# EasyEDA Pro project wireless charger controller.eprj

# Schematic Schematic1
Board Name: Board1; Create Date: 2025-02-25; Page Name: P1; Project Name: wireless charger controller; Schematic Name: Schematic1; Update Date: 2025-03-02; Company: 嘉立创EDA; Page Size: A4; Version: V1.0
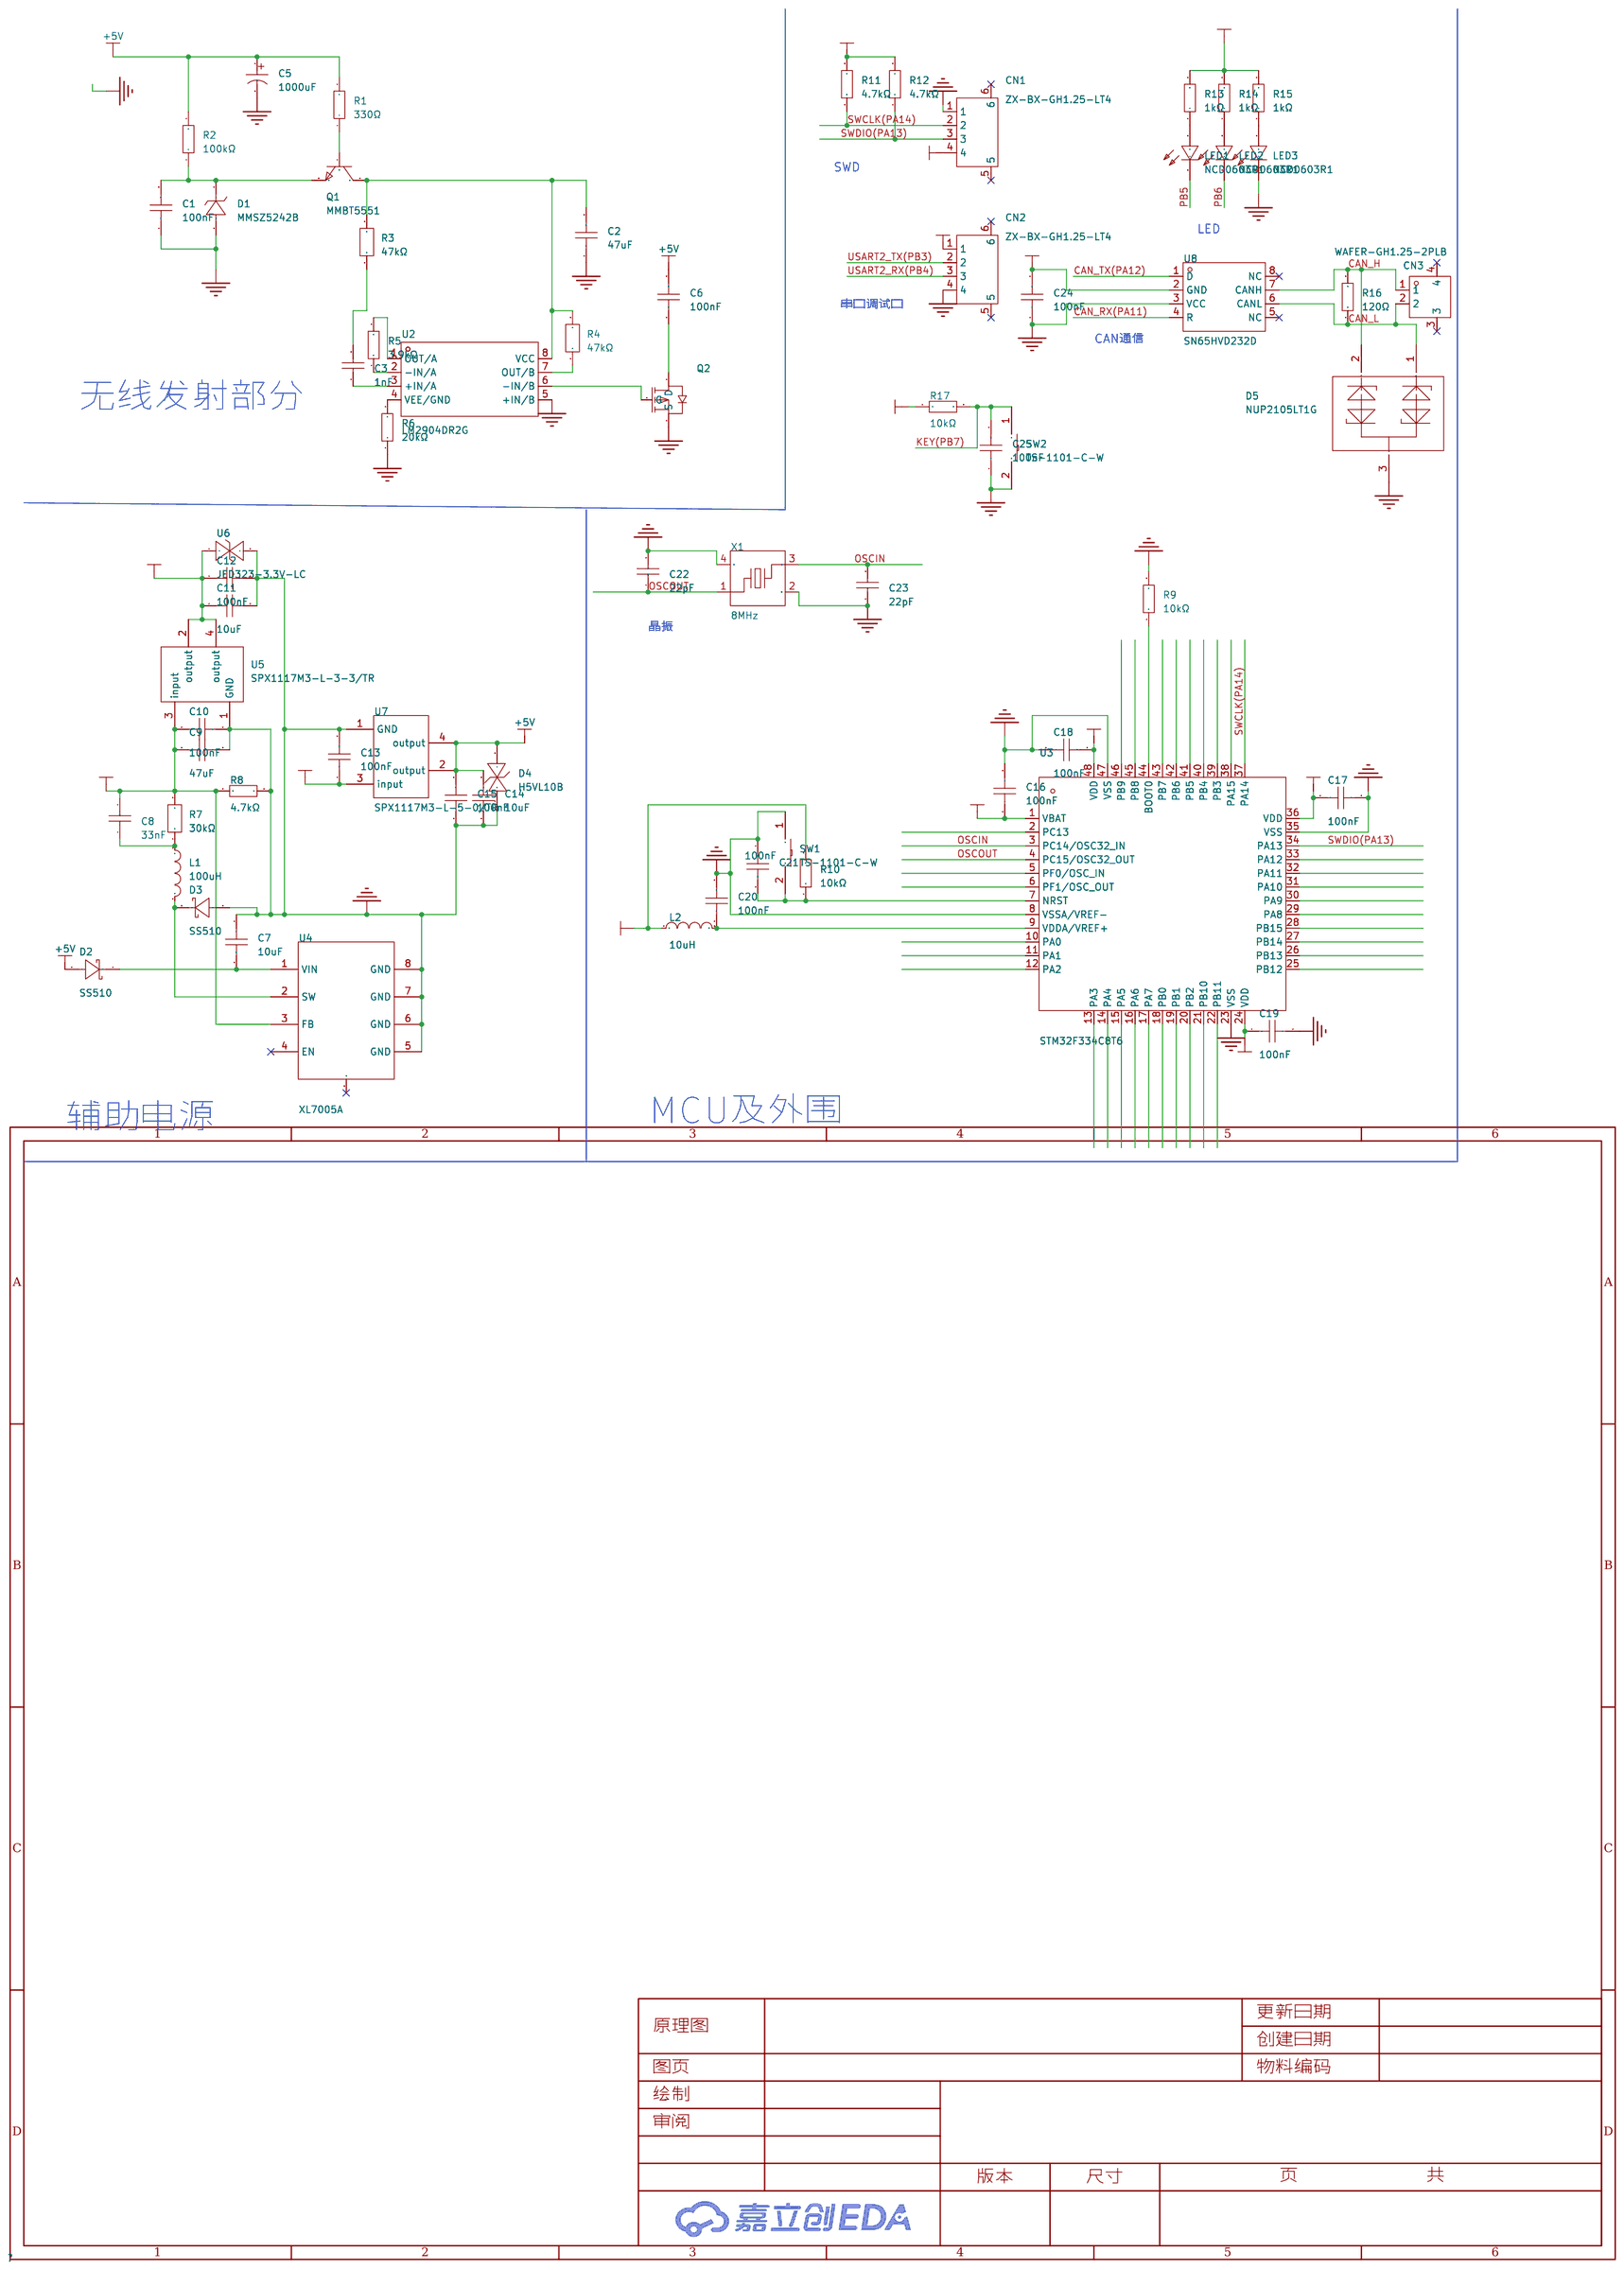
[diagram p0: schematic sheet]

## Parts
C1  100nF  [C0603]
C2  47uF  [C1206]
C3  1nF  [C0603]
C5  1000uF  [CAP-TH_BD13.0-P5.00-D1.2-FD]
C6  100nF  [C1206]
C7  10uF  [C1206]
C8  33nF  [C0603]
C9  47uF  [C1206]
C10  100nF  [C0603]
C11  10uF  [C0603]
C12  100nF  [C0603]
C13  100nF  [C0603]
C14  10uF  [C0603]
C15  100nF  [C0603]
C16  100nF  [C0603]
C17  100nF  [C0603]
C18  100nF  [C0603]
C19  100nF  [C0603]
C20  100nF  [C0603]
C21  100nF  [C0603]
C22  22pF  [C0603]
C23  22pF  [C0603]
C24  100nF  [C0603]
C25  100nF  [C0603]
CN1  ZX-BX-GH1.25-LT4  [CONN-SMD_ZX-BX-GH1.25-LT4]
CN2  ZX-BX-GH1.25-LT4  [CONN-SMD_ZX-BX-GH1.25-LT4]
CN3  WAFER-GH1.25-2PLB  [CONN-TH_2P-P1.25_XUNPU_WAFER-GH1.25-2PLB]
D1  MMSZ5242B  [SOD-123_L2.7-W1.6-LS3.7-RD]
D2  SS510  [SMA_L4.3-W2.6-LS5.0-RD]
D3  SS510  [SMA_L4.3-W2.6-LS5.0-RD]
D4  H5VL10B  [SOD-882_L1.0-W0.6-BI]
D5  NUP2105LT1G  [SOT-23-3_L2.9-W1.3-P1.90-LS2.4-BL-2]
L1  100uH  [IND-SMD_L6.0-W6.0_FNR60XXS]
L2  10uH  [L0603]
LED1  NCD0603R1  [LED0603-RD_RED]
LED2  NCD0603R1  [LED0603-RD_RED]
LED3  NCD0603R1  [LED0603-RD_RED]
Q1  MMBT5551  [SOT-23-3_L2.9-W1.3-P1.90-LS2.4-BR]
Q2  -  [IRF9540P_TO-220]
R1  330Ω  [R0603]
R2  100kΩ  [R0603]
R3  47kΩ  [R0603]
R4  47kΩ  [R0603]
R5  3.9kΩ  [R0603]
R6  20kΩ  [R0603]
R7  30kΩ  [R0603]
R8  4.7kΩ  [R0603]
R9  10kΩ  [R0603]
R10  10kΩ  [R0603]
R11  4.7kΩ  [R0603]
R12  4.7kΩ  [R0603]
R13  1kΩ  [R0603]
R14  1kΩ  [R0603]
R15  1kΩ  [R0603]
R16  120Ω  [R0603]
R17  10kΩ  [R0603]
SW1  TS-1101-C-W  [SW-SMD_L6.0-W3.3-LS8.0]
SW2  TS-1101-C-W  [SW-SMD_L6.0-W3.3-LS8.0]
U2  LM2904DR2G  [SOIC-8_L4.9-W3.9-P1.27-LS6.0-BL]
U3  STM32F334C8T6  [LQFP-48_L7.0-W7.0-P0.50-LS9.0-BL]
U4  XL7005A  [SOIC-8_L4.9-W3.9-P1.27-LS6.0-BL-EP3.1-1]
U5  SPX1117M3-L-3-3/TR  [SOT-223-4_L6.5-W3.5-P2.30-LS7.0-BR]
U6  JED323-3.3V-LC  [SOD-323_L1.7-W1.3-LS2.5-BI]
U7  SPX1117M3-L-5-0/TR  [SOT-223-4_L6.5-W3.5-P2.30-LS7.0-BR]
U8  SN65HVD232D  [SOIC-8_L4.9-W3.9-P1.27-LS6.0-TL]
X1  8MHz  [CRYSTAL-SMD_4P-L3.2-W2.5-BL]

## Library data of the parts
C1 C10 C12 C13 C15-C21 C24 C25 = CGA0603X7R104K500JT: LCSC Part Name: 100nF ±10% 50V; Supplier Part: C6119867; Manufacturer: HRE(芯声); Supplier Footprint: 0603; JLCPCB Part Class: 扩展库; Supplier: LCSC; Tolerance: ±10%; Voltage Rated: 50V; Temperature Coefficient: X7R
C2 = HGC1206R5476M160NSPJ: LCSC Part Name: 47uF ±20% 16V; Supplier Part: C7472975; Manufacturer: Chinocera(华瓷); Supplier Footprint: 1206; JLCPCB Part Class: 扩展库; Datasheet: https://atta.szlcsc.com/upload/public/pdf/source/20240320/FAC3FEC40A78BC5CCCE96C232A94D860.pdf; Supplier: LCSC; Tolerance: ±20%; Voltage Rated: 16V; Temperature Coefficient: X5R
C3 = CC0603JRNPO9BN102: LCSC Part Name: 1nF ±5% 50V; Supplier Part: C106246; Manufacturer: YAGEO(国巨); Supplier Footprint: 0603; JLCPCB Part Class: 扩展库; Datasheet: https://atta.szlcsc.com/upload/public/pdf/source/20170505/1493957838062.pdf; Supplier: LCSC; Tolerance: ±5%; Voltage Rated: 50V; Temperature Coefficient: NP0
C5 = 35YXJ1000M12.5X20: LCSC Part Name: 1000uF ±20% 35V; Supplier Part: C88743; Manufacturer: rubycon(红宝石); Supplier Footprint: 插件,D12.5xL20mm; JLCPCB Part Class: 扩展库; Datasheet: https://atta.szlcsc.com/upload/public/pdf/source/20200113/C88743_7A9E1D91AFF2E9AFD34B160DBDD0EC66.pdf; Supplier: LCSC; Tolerance: ±20%; Rated Voltage: 35V; Lead Spacing: 5mm; φD: 12.5mm; L: 20mm; Lifetime @ Temp: 10000hrs@105℃
C6 = CGA1206X7R104K251NT: LCSC Part Name: 100nF ±10% 250V; Supplier Part: C7503480; Manufacturer: HRE(芯声); Supplier Footprint: 1206; JLCPCB Part Class: 扩展库; Datasheet: https://atta.szlcsc.com/upload/public/pdf/source/20240119/D701C2A0801BCB6D531D69151EC650B3.pdf; Supplier: LCSC; Tolerance: ±10%; Voltage Rated: 250V; Temperature Coefficient: X7R
C7 = HGC1206R5106K500NSPJ: LCSC Part Name: 10uF ±10% 50V; Supplier Part: C7432781; Manufacturer: Chinocera(华瓷); Supplier Footprint: 1206; JLCPCB Part Class: 扩展库; Datasheet: https://atta.szlcsc.com/upload/public/pdf/source/20240320/FAC3FEC40A78BC5CCCE96C232A94D860.pdf; Supplier: LCSC; Tolerance: ±10%; Voltage Rated: 50V; Temperature Coefficient: X5R
C8 = CL10B333KB8NNNC: LCSC Part Name: 33nF ±10% 50V; Supplier Part: C21117; Manufacturer: SAMSUNG(三星); Supplier Footprint: 0603; JLCPCB Part Class: 基础库; Datasheet: https://atta.szlcsc.com/upload/public/pdf/source/20160218/1457707763339.pdf; Supplier: LCSC; Tolerance: ±10%; Voltage Rated: 50V; Temperature Coefficient: X7R
C9 = HGC1206R5476M250NSPJ: LCSC Part Name: 47uF ±20% 25V; Supplier Part: C22367835; Manufacturer: Chinocera(华瓷); Supplier Footprint: 1206; JLCPCB Part Class: 扩展库; Datasheet: https://atta.szlcsc.com/upload/public/pdf/source/20240326/E6CB0DC43BB858B74F4352229FABFDCA.pdf; Supplier: LCSC; Tolerance: ±20%; Voltage Rated: 25V; Temperature Coefficient: X5R
C11 C14 = CGA0603X5R106K100JT: LCSC Part Name: 10uF ±10% 10V; Supplier Part: C6119842; Manufacturer: HRE(芯声); Supplier Footprint: 0603; JLCPCB Part Class: 扩展库; Supplier: LCSC; Tolerance: ±10%; Voltage Rated: 10V; Temperature Coefficient: X5R
C22 C23 = CC0603JRNPO9BN220: LCSC Part Name: 22pF ±5% 50V; Supplier Part: C105620; Manufacturer: YAGEO(国巨); Supplier Footprint: 0603; JLCPCB Part Class: 扩展库; Datasheet: https://atta.szlcsc.com/upload/public/pdf/source/20170505/1493957838062.pdf; Supplier: LCSC; Tolerance: ±5%; Voltage Rated: 50V; Temperature Coefficient: NP0
CN1 CN2 = ZX-BX-GH1.25-LT4: LCSC Part Name: 1x4P 间距:1.25mm 立贴 系列:GH; Supplier Part: C7429508; Manufacturer: Megastar(兆星); Supplier Footprint: SMD,P=1.25mm; JLCPCB Part Class: 扩展库; Datasheet: https://atta.szlcsc.com/upload/public/pdf/source/20230619/3EA3860FAE766B302258B62130360A2E.pdf; Supplier: LCSC; Pins Structure: 1x4P; Pitch: 1.25mm; Mounting Type: 立贴; Reference Series: GH; Number of Pins: 4P; Number of Rows: 1; Number of PINs Per Row: 4; Contact Material: 磷铜; Contact Plating: 锡; Supplementary Features: 辅助焊脚; Color: 米色; Z-Height of the Board: 4.2mm; X-Length of Bottom Edge on Board (Spacing Line): 8.25mm; Y-Width of Bottom Edge on Board: 4.25mm
CN3 = WAFER-GH1.25-2PLB: LCSC Part Name: 1x2P 间距:1.25mm 立贴 系列:GH; Supplier Part: C3029368; Manufacturer: XUNPU(讯普); Supplier Footprint: SMD,P=1.25mm; JLCPCB Part Class: 扩展库; Datasheet: https://atta.szlcsc.com/upload/public/pdf/source/20220527/44F824AAC8C2B617205E15955FF9C23D.pdf; Supplier: LCSC; Pins Structure: 1x2P; Pitch: 1.25mm; Mounting Type: 立贴; Reference Series: GH; Number of Pins: 2P; Number of Rows: 1; Number of PINs Per Row: 2; Current Rating: 1A; Contact Material: 黄铜; Operating Temperature: -25℃~+85℃; Voltage Rating: 125V; Plastic Material: LCP; Supplementary Features: 辅助焊脚; Color: 米色; Z-Height of the Board: 4.2mm; X-Length of Bottom Edge on Board (Spacing Line): 5.75mm; Y-Width of Bottom Edge on Board: 4.95mm
D1 = MMSZ5242B_C19077426: Supplier Part: C19077426; Manufacturer: 宏嘉诚; Supplier Footprint: SOD-123; JLCPCB Part Class: 扩展库; Datasheet: https://atta.szlcsc.com/upload/public/pdf/source/20250106/06B28F2C24D17E0AE22ECF6A1A26EDF7.pdf; Supplier: LCSC; Diode Configuration: 独立式; Zener Voltage(Nom): 12V; Reverse Leakage Current (Ir): 1uA@9.1V; Zener Voltage(Range): 11.4V~12.6V; Pd - Power Dissipation(Pd): 500mW; Impedance(Zzt): 30Ω
D2 D3 = SS510_C18199171: LCSC Part Name: 电压:100V 电流:5A; Supplier Part: C18199171; Manufacturer: 宏迦橙; Supplier Footprint: SMA(DO-214AC); JLCPCB Part Class: 扩展库; Datasheet: https://atta.szlcsc.com/upload/public/pdf/source/20230828/254C3882F8647358AD9F60DD73611B5E.pdf; Supplier: LCSC; Diode Configuration: 独立式; Forward Voltage (Vf@If): 850mV@5A; Reverse Voltage (Vr): 100V; Rectified Current: 5A; Reverse Leakage Current (Ir): 50uA@100V
D4 = H5VL10B: LCSC Part Name: H5VL10B 丝印 PB; Supplier Part: C7420372; Manufacturer: 宏迦橙; Supplier Footprint: DFN1006-2L; JLCPCB Part Class: 扩展库; Datasheet: https://atta.szlcsc.com/upload/public/pdf/source/20230630/5024ECFEAD3C9801B07A8DBB967AB462.pdf; Supplier: LCSC; polarity: 双向; Reverse Stand-Off Voltage (Vrwm): 5V; Maximum Clamping Voltage: 10V; Peak Pulse Current (Ipp): 5A; Peak Pulse Power Dissipation (Ppp): 50W; Breakdown Voltage: 5.6V; Reverse Leakage Current (Ir): 100nA; Number of Lines: 单路; Operating Temperature: -55℃~+155℃; Type: ESD
D5 = NUP2105LT1G_C14486: Supplier Part: C14486; Manufacturer: onsemi(安森美); Supplier Footprint: SOT-23; JLCPCB Part Class: 扩展库; Datasheet: https://atta.szlcsc.com/upload/public/pdf/source/20140815/1457707217812.pdf; Supplier: LCSC; Reverse Stand-Off Voltage (Vrwm): 24V; Maximum Clamping Voltage: 44V; Peak Pulse Power Dissipation (Ppp)@10/1000us: 350W; Breakdown Voltage: 26.2V; Number of Lines: 双路; Operating Temperature: -55℃~+150℃@(Tj); Type: ESD
L1 = FNR6045S101MT: LCSC Part Name: 100uH ±20% 1A; Supplier Part: C168095; Manufacturer: cjiang(长江微电); Supplier Footprint: SMD,6x6mm; JLCPCB Part Class: 扩展库; Datasheet: https://atta.szlcsc.com/upload/public/pdf/source/20190327/C167925_9EFF0AABC4CA629C2CC95961DBF7D39D.pdf; Supplier: LCSC; Tolerance: ±20%; Rated Current: 880mA; Saturation Current (Isat): 1A; DC Resistance (DCR): 563mΩ
L2 = MCL1608S100MT: LCSC Part Name: 10uH ±20%; Supplier Part: C51942; Manufacturer: Sunlord(顺络); Supplier Footprint: 0603; JLCPCB Part Class: 扩展库; Datasheet: https://atta.szlcsc.com/upload/public/pdf/source/20241120/F98A73BCE98B3F58AF96E60C5F2B82D5.pdf; Supplier: LCSC; Tolerance: ±20%; Current Rating: 50mA; DC Resistance(DCR): 1.17Ω; Frequency - Self Resonant: 20MHz
LED1-LED3 = NCD0603R1_C84263: Supplier Part: C84263; Manufacturer: 国星光电; Supplier Footprint: 0603; JLCPCB Part Class: 扩展库; Datasheet: https://atta.szlcsc.com/upload/public/pdf/source/20200820/C84263_DABC6A75E58F576973B407FDBA283D60.pdf; Supplier: LCSC; Emitted Color: 红色; Forward Voltage (VF): 1.6V~2.6V; Power Dissipation: 65mW; Forward Current: 20mA; Dominant Wavelength: 615nm~630nm; Diode Configuration: 独立二极管; Lens Color: 无色透明透镜; Luminous Intensity: 80mcd~220mcd; Viewing Angle: 130°; Operating Temperature: -30℃~+85℃
Q1 = MMBT5551_C7420357: LCSC Part Name: hFE:100-300; Supplier Part: C7420357; Manufacturer: 宏迦橙; Supplier Footprint: SOT-23; JLCPCB Part Class: 扩展库; Datasheet: https://atta.szlcsc.com/upload/public/pdf/source/20231222/D38E1B30E95EC4C2952AC0E289834E8E.pdf; Supplier: LCSC; Transistor Type: NPN; Collector Current (Ic): 600mA; Collector-Emitter Breakdown Voltage (Vceo): 160V; Power Dissipation (Pd): 300mW; DC Current Gain (hFE@Ic,Vce): 100@10mA,5.0V; Transition Frequency (fT): 100MHz; Collector Cut-Off Current (Icbo): 50nA; Collector-Emitter Saturation Voltage (VCE(sat)@Ic,Ib): 150mV@10mA,1.0mA; Operating Temperature: -55℃~+150℃
Q2 = IRF9540_P: Supplier Footprint: TO-220-3
R1 = 0603WAF3300T5E: LCSC Part Name: 330Ω ±1% 100mW 厚膜电阻; Supplier Part: C23138; Manufacturer: UNI-ROYAL(厚声); Supplier Footprint: 0603; JLCPCB Part Class: 基础库; Datasheet: https://atta.szlcsc.com/upload/public/pdf/source/20200306/C422600_1E6D84923E4A46A82E41ADD87F860B5C.pdf; Supplier: LCSC; Type: 厚膜电阻; Tolerance: ±1%; Power(Watts): 100mW; Overload Voltage (Max): 75V; Temperature Coefficient: ±100ppm/℃; Operating Temperature Range: -55℃~+155℃
R2 = 0603WAF1003T5E: LCSC Part Name: 100kΩ ±1% 100mW 厚膜电阻; Supplier Part: C25803; Manufacturer: UNI-ROYAL(厚声); Supplier Footprint: 0603; JLCPCB Part Class: 基础库; Datasheet: https://atta.szlcsc.com/upload/public/pdf/source/20200306/C422600_1E6D84923E4A46A82E41ADD87F860B5C.pdf; Supplier: LCSC; Type: 厚膜电阻; Tolerance: ±1%; Power(Watts): 100mW; Overload Voltage (Max): 75V; Temperature Coefficient: ±100ppm/℃; Operating Temperature Range: -55℃~+155℃
R3 R4 = FRC0603F4702TS: LCSC Part Name: 47kΩ ±1% 100mW 厚膜电阻; Supplier Part: C2907042; Manufacturer: FOJAN(富捷); Supplier Footprint: 0603; JLCPCB Part Class: 扩展库; Datasheet: https://atta.szlcsc.com/upload/public/pdf/source/20211221/925EC7D7225764EE0046F22065062C87.pdf; Supplier: LCSC; Type: 厚膜电阻; Tolerance: ±1%; Power(Watts): 100mW; Overload Voltage (Max): 75V; Temperature Coefficient: ±100ppm/℃; Operating Temperature Range: -55℃~+155℃
R5 = 0603WAF3901T5E: LCSC Part Name: 3.9kΩ ±1% 100mW 厚膜电阻; Supplier Part: C23018; Manufacturer: UNI-ROYAL(厚声); Supplier Footprint: 0603; JLCPCB Part Class: 基础库; Datasheet: https://atta.szlcsc.com/upload/public/pdf/source/20200306/C422600_1E6D84923E4A46A82E41ADD87F860B5C.pdf; Supplier: LCSC; Type: 厚膜电阻; Tolerance: ±1%; Power(Watts): 100mW; Overload Voltage (Max): 75V; Temperature Coefficient: ±100ppm/℃; Operating Temperature Range: -55℃~+155℃
R6 = 0603WAF2002T5E: LCSC Part Name: 20kΩ ±1% 100mW 厚膜电阻; Supplier Part: C4184; Manufacturer: UNI-ROYAL(厚声); Supplier Footprint: 0603; JLCPCB Part Class: 基础库; Datasheet: https://atta.szlcsc.com/upload/public/pdf/source/20200306/C422600_1E6D84923E4A46A82E41ADD87F860B5C.pdf; Supplier: LCSC; Type: 厚膜电阻; Tolerance: ±1%; Power(Watts): 100mW; Overload Voltage (Max): 75V; Temperature Coefficient: ±100ppm/℃; Operating Temperature Range: -55℃~+155℃
R7 = FRC0603F3002TS: LCSC Part Name: 30kΩ ±1% 100mW 厚膜电阻; Supplier Part: C2907025; Manufacturer: FOJAN(富捷); Supplier Footprint: 0603; JLCPCB Part Class: 扩展库; Datasheet: https://atta.szlcsc.com/upload/public/pdf/source/20211221/925EC7D7225764EE0046F22065062C87.pdf; Supplier: LCSC; Type: 厚膜电阻; Tolerance: ±1%; Power(Watts): 100mW; Overload Voltage (Max): 75V; Temperature Coefficient: ±100ppm/℃; Operating Temperature Range: -55℃~+155℃
R8 R11 R12 = 0603WAF4701T5E: LCSC Part Name: 4.7kΩ ±1% 100mW 厚膜电阻; Supplier Part: C23162; Manufacturer: UNI-ROYAL(厚声); Supplier Footprint: 0603; JLCPCB Part Class: 基础库; Datasheet: https://atta.szlcsc.com/upload/public/pdf/source/20200306/C422600_1E6D84923E4A46A82E41ADD87F860B5C.pdf; Supplier: LCSC; Type: 厚膜电阻; Tolerance: ±1%; Power(Watts): 100mW; Overload Voltage (Max): 75V; Temperature Coefficient: ±100ppm/℃; Operating Temperature Range: -55℃~+155℃
R9 R10 R17 = 0603WAF1002T5E: LCSC Part Name: 厚膜电阻 10kΩ ±1% 100mW; Supplier Part: C25804; Manufacturer: UNI-ROYAL(厚声); Supplier Footprint: 0603; JLCPCB Part Class: Basic Part; Datasheet: https://atta.szlcsc.com/upload/public/pdf/source/20200306/C422600_1E6D84923E4A46A82E41ADD87F860B5C.pdf; Supplier: LCSC; Type: 厚膜电阻; Tolerance: ±1%; Power(Watts): 100mW; Overload Voltage (Max): 75V; Temperature Coefficient: ±100ppm/℃; Operating Temperature Range: -55℃~+155℃
R13-R15 = 0603WAF1001T5E: LCSC Part Name: 1kΩ ±1% 100mW 厚膜电阻; Supplier Part: C21190; Manufacturer: UNI-ROYAL(厚声); Supplier Footprint: 0603; JLCPCB Part Class: 基础库; Datasheet: https://atta.szlcsc.com/upload/public/pdf/source/20200306/C422600_1E6D84923E4A46A82E41ADD87F860B5C.pdf; Supplier: LCSC; Type: 厚膜电阻; Tolerance: ±1%; Power(Watts): 100mW; Overload Voltage (Max): 75V; Temperature Coefficient: ±100ppm/℃; Operating Temperature Range: -55℃~+155℃
R16 = 0603WAF1200T5E: LCSC Part Name: 120Ω ±1% 100mW 厚膜电阻; Supplier Part: C22787; Manufacturer: UNI-ROYAL(厚声); Supplier Footprint: 0603; JLCPCB Part Class: 基础库; Datasheet: https://atta.szlcsc.com/upload/public/pdf/source/20200306/C422600_1E6D84923E4A46A82E41ADD87F860B5C.pdf; Supplier: LCSC; Type: 厚膜电阻; Tolerance: ±1%; Power(Watts): 100mW; Overload Voltage (Max): 75V; Temperature Coefficient: ±100ppm/℃; Operating Temperature Range: -55℃~+155℃
SW1 SW2 = TS-1101-C-W: LCSC Part Name: 6*3.6*2.5mm 立贴 轻触开关; Supplier Part: C318938; Manufacturer: XKB Connectivity(中国星坤); Supplier Footprint: SMD; JLCPCB Part Class: 扩展库; Datasheet: https://atta.szlcsc.com/upload/public/pdf/source/20200227/C318938_C2E53B1EEDE37D980A33616AC086DE53.pdf; Supplier: LCSC; Circuit: 单刀单掷; Actuator Style: 矩形按钮; Operating Force: 260gf; Mounting Style: 立贴; Switch Length: 6mm; Switch Width: 3.6mm; Switch Height: 2.5mm; Strike Gundam: 不带; Contact Current: 50mA; Voltage Rating (DC): 12V; Actuator/Cap Color: 白色带淡绿; With Lamp: 无; Mechanical Life: 5万次; Operating Temperature: -30℃~+85℃
U2 = LM2904DR2G: Supplier Part: C18229; Manufacturer: onsemi(安森美); Supplier Footprint: SOIC-8; JLCPCB Part Class: 扩展库; Datasheet: https://atta.szlcsc.com/upload/public/pdf/source/20241203/BA383AB6F92C1D3D0DD6D262792E2276.pdf; Supplier: LCSC; Number of Circuits: 双路; Maximum Power Supply Range (Vdd-Vss): 32V; Gain Bandwidth Product(GBP): 1MHz; Voltage - Input Offset(Vos): 7mV; Input Offset Voltage Drift (Vos TC): 7uV/℃; Current - Input Bias(Ib): 45nA; Common Mode Rejection Ratio (CMRR): 70dB; Quiescent Current: 1.5mA; Output Current: 40mA; Operating Temperature: -40℃~+85℃
U3 = STM32F334C8T6: LCSC Part Name: 带DSP和FPU的主流混合信号ARM Cortex-M4 MCU，具有64 KB Flash、72 MHz CPU、CCM、5 Msps 12位ADC、比较器、运算放大器和高分辨率定时器; Supplier Part: C99450; Manufacturer: ST(意法半导体); Supplier Footprint: LQFP-48(7x7); JLCPCB Part Class: 扩展库; Datasheet: https://atta.szlcsc.com/upload/public/pdf/source/20180105/C99450_15151501269081234225.pdf; Supplier: LCSC; CPU Core: ARM-M4; CPU Maximum Speed: 72MHz; Program Storage Size: 64KB; Program Memory Type: FLASH; Number of I/O: 37; ADC (Bit): 12bit; DAC (Bit): 12bit; Low Voltage Detection Threshold: 2V~3.6V
U4 = XL7005A: LCSC Part Name: 0.4A 150kHz 80V 降压型DC-DC转换器; Supplier Part: C50848; Manufacturer: XLSEMI(芯龙); Supplier Footprint: SOIC-8-EP; JLCPCB Part Class: 扩展库; Datasheet: https://atta.szlcsc.com/upload/public/pdf/source/20150821/1457707346919.pdf; Supplier: LCSC; Function: 降压型; Output Type: 可调; Input Voltage: 5V~80V; Output Voltage: 1.25V~20V; Output Current: 400mA; Switching Frequency: 150kHz; Operating Temperature: -40℃~+125℃; Number of Outputs: 1; Topology: 降压式
U5 = SPX1117M3-L-3-3/TR: Supplier Part: C6862; Manufacturer: MaxLinear(迈凌); Supplier Footprint: SOT-223; JLCPCB Part Class: 扩展库; Datasheet: https://atta.szlcsc.com/upload/public/pdf/source/20161024/1477287964949.pdf; Supplier: LCSC; Output Type: 固定; Maximum Input Voltage: 20V; Output Voltage: 3.3V; MAX Output Current: 800mA; Power Supply Rejection Ratio (PSRR): 70dB@(120Hz); Dropout Voltage: 1.3V@(800mA); standby current: 10mA; Operating Temperature: -40℃~+125℃; Output Polarity: 正极; Number of Outputs: 1
U6 = JED323-3.3V-LC: LCSC Part Name: 3.3V 1pF 双向; Supplier Part: C2982319; Manufacturer: JDTfuse(集电通); Supplier Footprint: SOD-323; JLCPCB Part Class: 扩展库; Datasheet: https://atta.szlcsc.com/upload/public/pdf/source/20220401/02977BCBB47D8A075F638B388D6852B2.pdf; Supplier: LCSC; polarity: 双向; Reverse Stand-Off Voltage (Vrwm): 3.3V; Maximum Clamping Voltage: 16V; Peak Pulse Current (Ipp): 21A; Peak Pulse Power Dissipation (Ppp): 340W; Breakdown Voltage: 3.3V; Reverse Leakage Current (Ir): 200nA; Number of Lines: 单路; Operating Temperature: -55℃~+125℃; Type: ESD
U7 = SPX1117M3-L-5-0/TR: LCSC Part Name: 输入20V 输出5V 800mA; Supplier Part: C21946; Manufacturer: MaxLinear(迈凌); Supplier Footprint: SOT-223-4; JLCPCB Part Class: 扩展库; Datasheet: https://atta.szlcsc.com/upload/public/pdf/source/20161024/1477287964949.pdf; Supplier: LCSC; Output Type: 固定; Maximum Input Voltage: 20V; Output Voltage: 5V; Output Current: 800mA; Power Supply Rejection Ratio (PSRR): 75dB@(120Hz); Dropout Voltage: 1.3V@(800mA); standby current: 10mA; Feature: 防静电保护；低ESR；热保护(TSD)；过流保护(OCP); Operating Temperature: -40℃~+125℃; Output Polarity: 正极; Number of Outputs: 1
U8 = SN65HVD232D: LCSC Part Name: SN65HVD230, SN65HVD231, SN65HVD232 3.3V CAN总线收发器; Supplier Part: C1544356; Manufacturer: TI(德州仪器); Supplier Footprint: SOIC-8; JLCPCB Part Class: 扩展库; Datasheet: https://www.ti.com/cn/lit/gpn/sn65hvd230; Supplier: LCSC; Type: CAN收发器; Data Rate: 1Mbps; Supply Voltage: 3V~3.6V; Supply Current: 17mA; Operating Temperature: -40℃~+85℃
X1 = X32258MOB4SI: LCSC Part Name: 8MHz ±10ppm 12pF; Supplier Part: C2682775; Manufacturer: YXC(扬兴晶振); Supplier Footprint: SMD3225-4P; JLCPCB Part Class: 扩展库; Datasheet: https://atta.szlcsc.com/upload/public/pdf/source/20240329/19D5F850207469550BEB00D7DFEDBC7A.pdf; Supplier: LCSC; Type: 贴片晶振; Normal temperature Frequency Tolerance: ±10ppm; Load Capacitance: 12pF; Frequency Stability: ±20ppm; Equivalent Series Resistance(ESR): 150Ω; Operating Temperature: -40℃~+85℃

## Nets
+3.3V: C11.1 C12.1 C16.1 C17.1 C18.2 C19.1 C24.2 CN1.4 CN2.1 L2.1 R10.1 R11.2 R12.2 R13.2 R14.2 R15.2 R17.1 U3.1(VBAT) U3.24(VDD) U3.36(VDD) U3.48(VDD) U5.2(output) U5.4(output) U6.1(K) U8.2(GND)
+5V: C5.1 C6.2 C14.2 C15.2 D2.2(A) D4.2(A) R1.2 R2.2 U7.2(output) U7.4(output)
+9.5V: C8.2 C9.1 C10.1 C13.1 R7.2 R8.2 U4.3(FB) U5.3(input) U7.3(input)
GND: C1.1 C2.1 C5.2 C7.1 C9.2 C10.2 C11.2 C12.2 C13.2 C14.1 C15.1 C16.2 C17.2 C18.1 C19.2 C20.2 C21.1 C22.2 C23.1 C24.1 C25.1 CN1.1 CN2.4 D1.2(A) D3.2(A) D4.1(C) D5.3 LED3.1(K) Q2.3(S) R6.1 R8.1 R9.2 SW1.1 SW2.2 U2.5(+IN/B) U3.8(VSSA/VREF-) U3.23(VSS) U3.35(VSS) U3.47(VSS) U4.5(GND) U4.6(GND) U4.7(GND) U4.8(GND) U5.1(GND) U6.2(A) U7.1(GND) U8.3(VCC) X1.2(GND) X1.4(GND)
CAN_H: CN3.1 D5.2 R16.2 U8.7(CANH)
CAN_L: CN3.2 D5.1 R16.1 U8.6(CANL)
CAN_RX(PA11): U8.4(R)
CAN_TX(PA12): U8.1(D)
KEY(PB7): C25.2 R17.2 SW2.1
OSCIN: C23.2 U3.3(PC14/OSC32_IN) X1.3
OSCOUT: C22.1 U3.4(PC15/OSC32_OUT) X1.1
PB5: LED1.1(K)
PB6: LED2.1(K)
SWCLK(PA14): CN1.2 R11.1 U3.37(PA14)
SWDIO(PA13): CN1.3 R12.1 U3.34(PA13)
USART2_RX(PB4): CN2.3
USART2_TX(PB3): CN2.2
$1N453: Q1.1(B) R1.1
$1N814: C1.2 D1.1(K) Q1.2(E) R2.1
$1N992: C2.2 Q1.3(C) R3.2 R4.2 U2.8(VCC)
$1N1076: R4.1 U2.7(OUT/B)
$1N1244: R5.2 U2.1(OUT/A)
$1N1249: R5.1 U2.2(-IN/A)
$1N1255: C3.1 U2.3(+IN/A)
$1N1263: C3.2 R3.1
$1N1418: R6.2 U2.4(VEE/GND)
$1N2800: Q2.1(G) U2.6(-IN/B)
$1N2805: C6.1 Q2.2(D)
$1N4162: C7.2 D2.1(K) U4.1(VIN)
$1N4276: D3.1(K) L1.2 U4.2(SW)
$1N4515: C8.1 L1.1 R7.1
$1N7418: C20.1 L2.2 U3.9(VDDA/VREF+)
$1N7653: R9.1 U3.44(BOOT0)
$1N7697: C21.2 R10.2 SW1.2 U3.7(NRST)
$1N8888: LED1.2(A) R13.1
$1N8934: LED2.2(A) R14.1
$1N8980: LED3.2(A) R15.1

Not connected (* = marked no-connect by the designer): CN1 5* 6*; CN2 5* 6*; CN3 3* 4*; U3 2(PC13) 5(PF0/OSC_IN) 6(PF1/OSC_OUT) 10(PA0) 11(PA1) 12(PA2) 13(PA3) 14(PA4) 15(PA5) 16(PA6) 17(PA7) 18(PB0) 19(PB1) 20(PB2) 21(PB10) 22(PB11) 25(PB12) 26(PB13) 27(PB14) 28(PB15) 29(PA8) 30(PA9) 31(PA10) 32(PA11) 33(PA12) 38(PA15) 39(PB3) 40(PB4) 41(PB5) 42(PB6) 43(PB7) 45(PB8) 46(PB9); U4 4(EN)* 9*; U8 5(NC)* 8(NC)*

## Notes on the sheet
- SWD
- LED
- 串口调试口
- CAN通信
- 无线发射部分
- 晶振
- 辅助电源
- MCU及外围

# Board PCB1
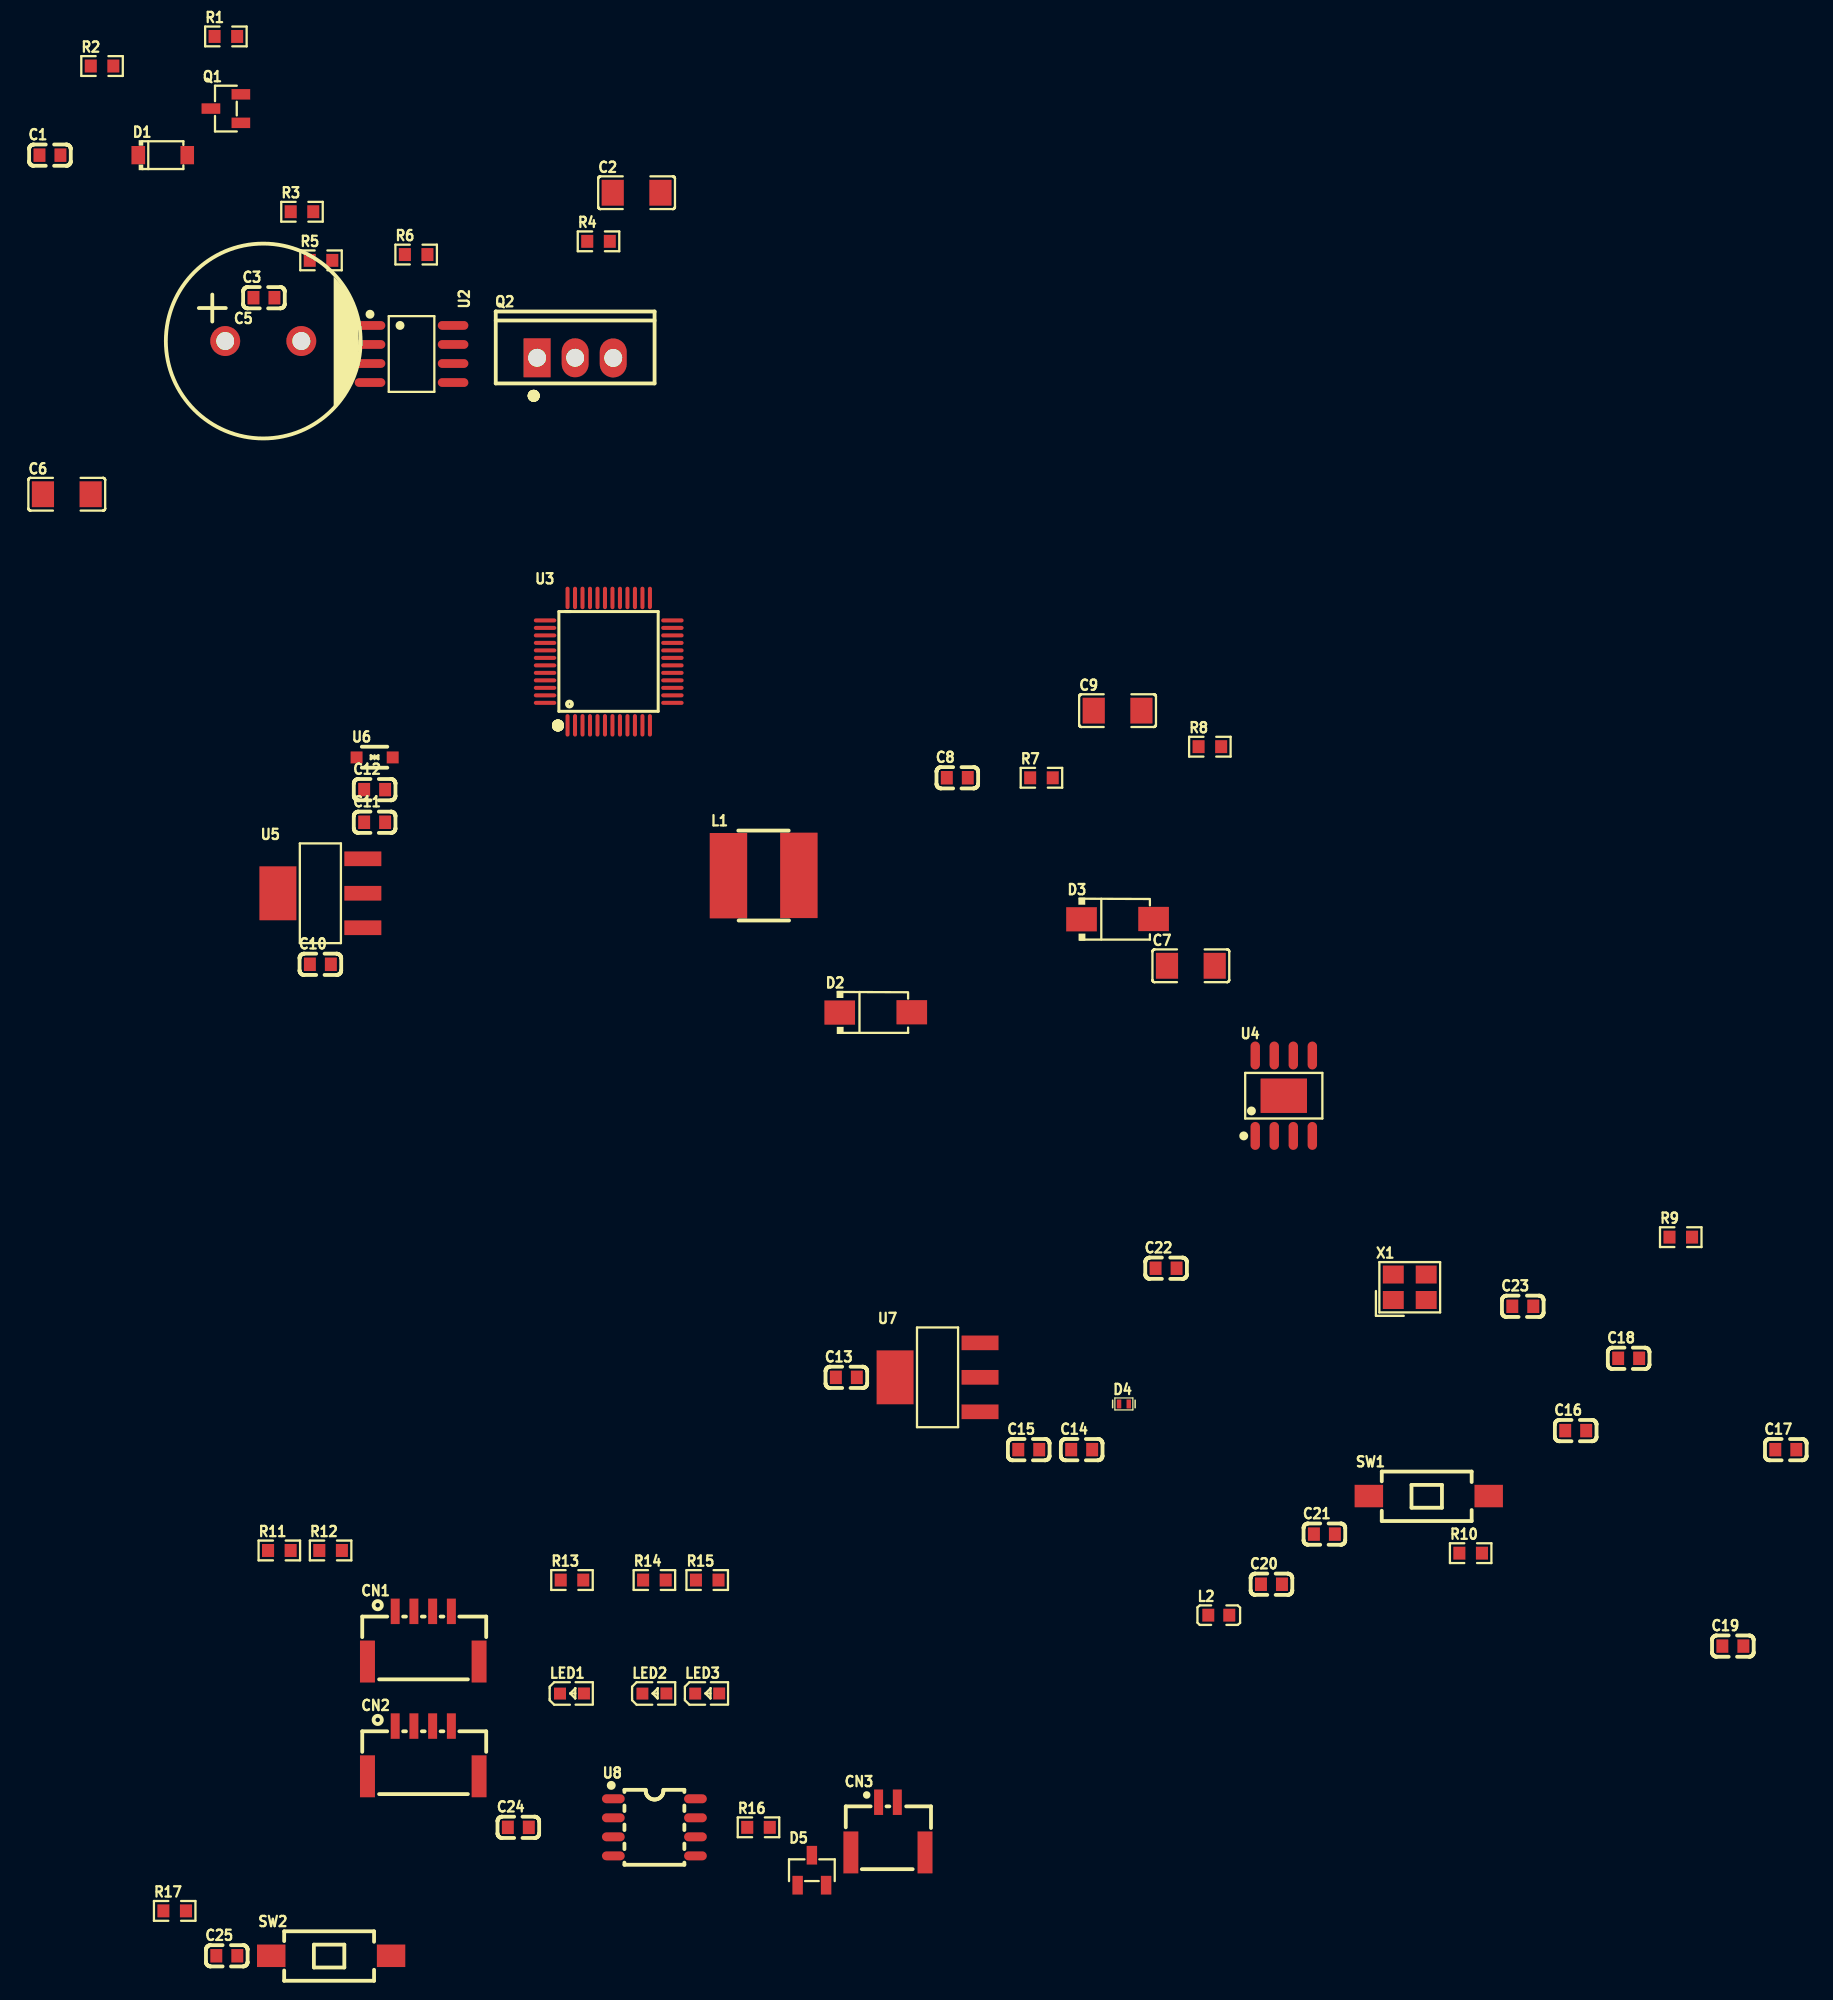
[diagram p1: board, top side]
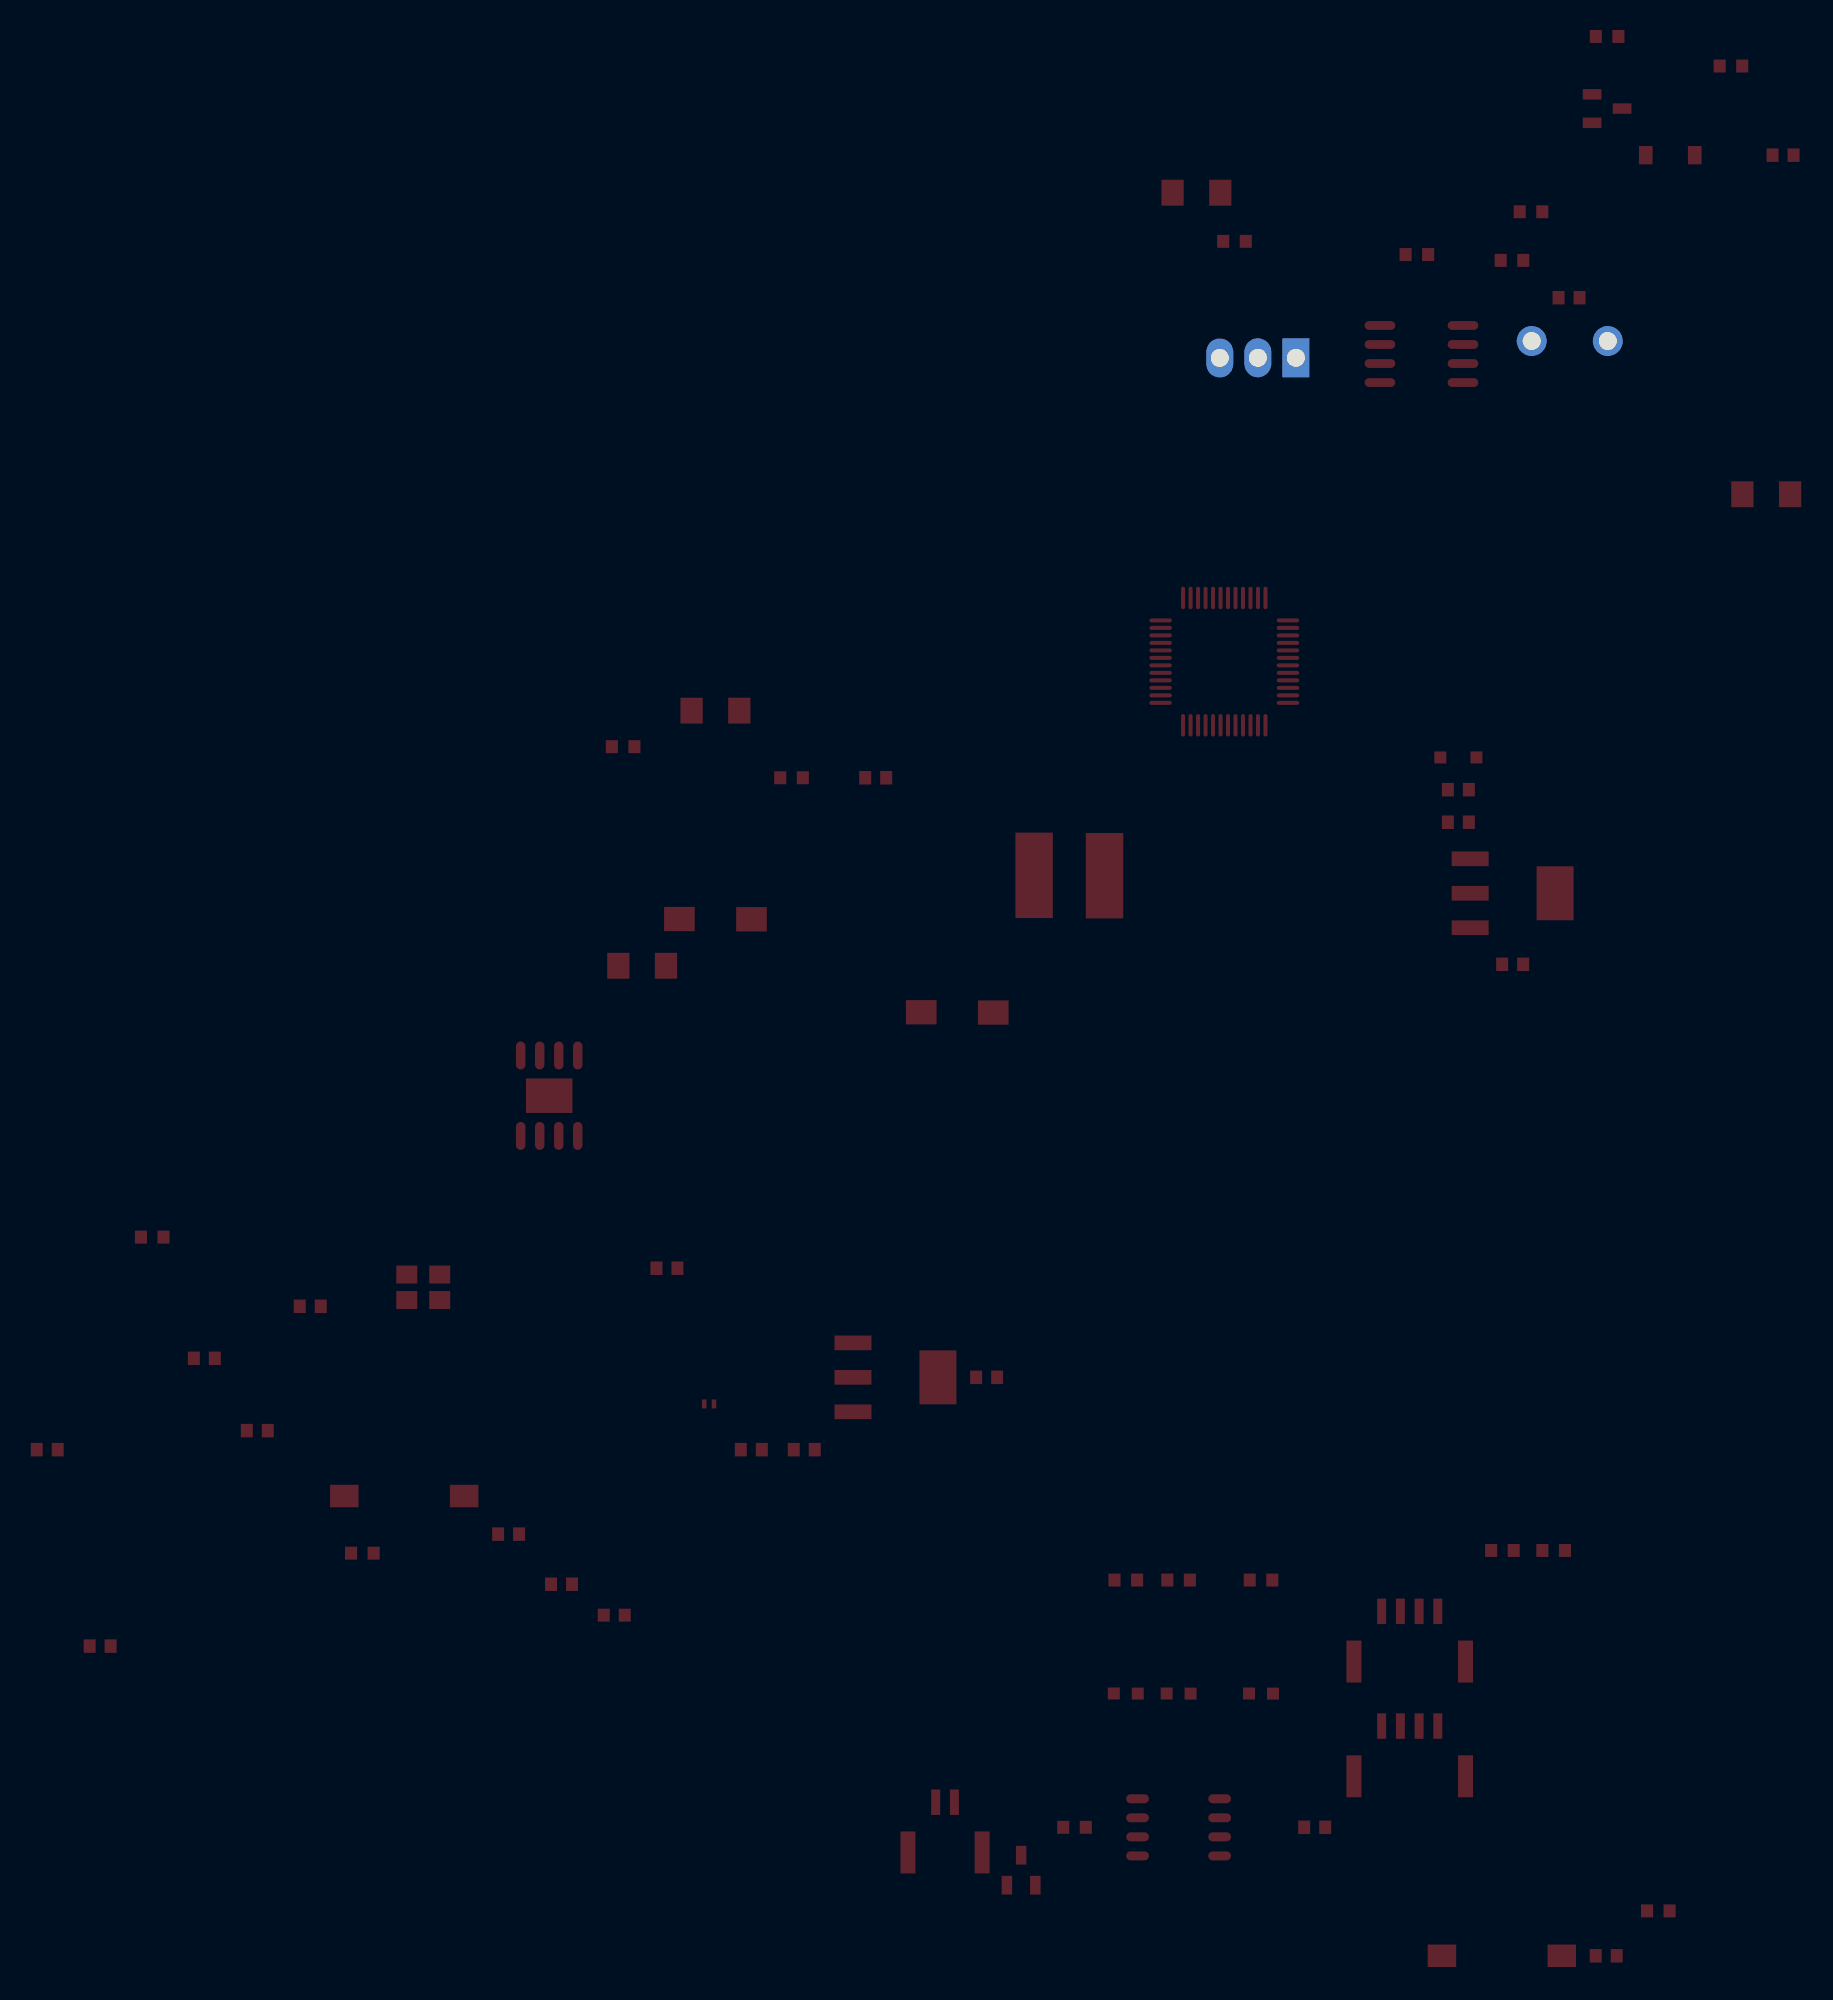
[diagram p2: board, bottom side, seen from below]

No outline. copper layers: Top Layer, Bottom Layer. Coordinates in mm from the lowest, leftmost part position.
Stack: Top Layer 0.035mm / Dielectric1 1.51mm FR4 er 4.5 / Bottom Layer 0.035mm

## Design rules (mm)
template: JLCPCB Capability(Two Layers Board)
spacing copperThickness1oz (default): track to track 0.102, other pairs 0.152 to 0.3
spacing copperThickness2oz: track to track 0.203, other pairs 0.152 to 0.3
track width copperThickness1oz (default): min 0.127, default 0.254, max 2.54
track width copperThickness2oz: min 0.203, default 0.254, max 2.54
differential pair differentialPair (default): width min 0.127, default 0.254, max 2.54; gap min 0.152, default 0.152
via viaSize (default): diameter min 0.5, default 0.61, max 10; hole min 0.3, default 0.305, max 6.3

## Placement (name value [footprint] x y rotation side)
C1  100nF  [C0603]  0 120.14 0 top
C2  47uF  [C1206]  39.16 117.63 0 top
C3  1nF  [C0603]  14.28 110.63 0 top
C5  1000uF  [CAP-TH_BD13.0-P5.00-D1.2-FD]  14.24 107.74 0 top
C6  100nF  [C1206]  1.12 97.52 0 top
C7  10uF  [C1206]  76.16 66.05 0 top
C8  33nF  [C0603]  60.57 78.6 0 top
C9  47uF  [C1206]  71.26 83.08 0 top
C10  100nF  [C0603]  18.05 66.15 0 top
C11  10uF  [C0603]  21.67 75.63 0 top
C12  100nF  [C0603]  21.67 77.81 0 top
C13  100nF  [C0603]  53.16 38.59 0 top
C14  10uF  [C0603]  68.87 33.77 0 top
C15  100nF  [C0603]  65.34 33.77 0 top
C16  100nF  [C0603]  101.85 35.04 0 top
C17  100nF  [C0603]  115.87 33.77 0 top
C18  100nF  [C0603]  105.38 39.87 0 top
C19  100nF  [C0603]  112.34 20.66 0 top
C20  100nF  [C0603]  81.54 24.79 0 top
C21  100nF  [C0603]  85.07 28.13 0 top
C22  22pF  [C0603]  74.5 45.87 0 top
C23  22pF  [C0603]  98.31 43.33 0 top
C24  100nF  [C0603]  31.27 8.57 0 top
C25  100nF  [C0603]  11.8 0 0 top
CN1  ZX-BX-GH1.25-LT4  [CONN-SMD_ZX-BX-GH1.25-LT4]  24.92 21.31 0 top
CN2  ZX-BX-GH1.25-LT4  [CONN-SMD_ZX-BX-GH1.25-LT4]  24.92 13.65 0 top
CN3  WAFER-GH1.25-2PLB  [CONN-TH_2P-P1.25_XUNPU_WAFER-GH1.25-2PLB]  55.94 8.57 0 top
D1  MMSZ5242B  [SOD-123_L2.7-W1.6-LS3.7-RD]  7.53 120.14 0 top
D2  SS510  [SMA_L4.3-W2.6-LS5.0-RD]  55.12 62.94 0 top
D3  SS510  [SMA_L4.3-W2.6-LS5.0-RD]  71.26 69.16 0 top
D4  H5VL10B  [SOD-882_L1.0-W0.6-BI]  71.69 36.82 0 top
D5  NUP2105LT1G  [SOT-23-3_L2.9-W1.3-P1.90-LS2.4-BL-2]  50.86 5.71 0 top
L1  100uH  [IND-SMD_L6.0-W6.0_FNR60XXS]  47.64 72.08 0 top
L2  10uH  [L0603]  78.02 22.73 0 top
LED1  NCD0603R1  [LED0603-RD_RED]  34.85 17.5 0 top
LED2  NCD0603R1  [LED0603-RD_RED]  40.35 17.5 0 top
LED3  NCD0603R1  [LED0603-RD_RED]  43.87 17.5 0 top
Q1  MMBT5551  [SOT-23-3_L2.9-W1.3-P1.90-LS2.4-BR]  11.74 123.25 0 top
Q2  -  [IRF9540P_TO-220]  35.06 106.62 0 top
R1  330Ω  [R0603]  11.74 128.06 0 top
R2  100kΩ  [R0603]  3.48 126.09 0 top
R3  47kΩ  [R0603]  16.82 116.36 0 top
R4  47kΩ  [R0603]  36.62 114.39 0 top
R5  3.9kΩ  [R0603]  18.09 113.12 0 top
R6  20kΩ  [R0603]  24.44 113.51 0 top
R7  30kΩ  [R0603]  66.18 78.6 0 top
R8  4.7kΩ  [R0603]  77.43 80.67 0 top
R9  10kΩ  [R0603]  108.86 47.95 0 top
R10  10kΩ  [R0603]  94.84 26.86 0 top
R11  4.7kΩ  [R0603]  15.31 27.04 0 top
R12  4.7kΩ  [R0603]  18.73 27.04 0 top
R13  1kΩ  [R0603]  34.85 25.07 0 top
R14  1kΩ  [R0603]  40.35 25.07 0 top
R15  1kΩ  [R0603]  43.87 25.07 0 top
R16  120Ω  [R0603]  47.3 8.57 0 top
R17  10kΩ  [R0603]  8.33 3 0 top
SW1  TS-1101-C-W  [SW-SMD_L6.0-W3.3-LS8.0]  92.04 30.67 0 top
SW2  TS-1101-C-W  [SW-SMD_L6.0-W3.3-LS8.0]  18.77 0 0 top
U2  LM2904DR2G  [SOIC-8_L4.9-W3.9-P1.27-LS6.0-BL]  24.14 106.87 270 top
U3  STM32F334C8T6  [LQFP-48_L7.0-W7.0-P0.50-LS9.0-BL]  37.3 86.35 0 top
U4  XL7005A  [SOIC-8_L4.9-W3.9-P1.27-LS6.0-BL-EP3.1-1]  82.36 57.39 0 top
U5  SPX1117M3-L-3-3/TR  [SOT-223-4_L6.5-W3.5-P2.30-LS7.0-BR]  18.05 70.89 0 top
U6  JED323-3.3V-LC  [SOD-323_L1.7-W1.3-LS2.5-BI]  21.67 79.95 0 top
U7  SPX1117M3-L-5-0/TR  [SOT-223-4_L6.5-W3.5-P2.30-LS7.0-BR]  59.25 38.59 0 top
U8  SN65HVD232D  [SOIC-8_L4.9-W3.9-P1.27-LS6.0-TL]  40.35 8.57 0 top
X1  8MHz  [CRYSTAL-SMD_4P-L3.2-W2.5-BL]  90.77 44.6 0 top

## Footprints (pads in the part's own frame, mm; a bottom-side part is the same pattern mirrored in y, then rotated)
C0603
  rect 0.8x0.9 smd: 1(-0.7,0) 2(0.7,0)
C1206
  rect 1.485x1.728 smd: 1(-1.593,0) 2(1.593,0)
CAP-TH_BD13.0-P5.00-D1.2-FD
  round 2 hole 1.2: 1(-2.54,0) 2(2.54,0)
CONN-SMD_ZX-BX-GH1.25-LT4
  rect 0.6x1.7 smd: 1(-1.875,1.675) 2(-0.625,1.675) 3(0.625,1.675) 4(1.875,1.675)
  rect 1x2.8 smd: 5(3.725,-1.675) 6(-3.725,-1.675)
CONN-TH_2P-P1.25_XUNPU_WAFER-GH1.25-2PLB
  rect 0.6x1.7 smd: 1(-0.625,1.675) 2(0.625,1.675)
  rect 1x2.8 smd: 3(2.475,-1.675) 4(-2.475,-1.675)
CRYSTAL-SMD_4P-L3.2-W2.5-BL
  rect 1.4x1.2 smd: 1(-1.1,-0.85) 2(1.1,-0.85) 3(1.1,0.85) 4(-1.1,0.85)
IND-SMD_L6.0-W6.0_FNR60XXS
  rect 2.5x5.7 smd: 1(-2.35,-0.013) 2(2.35,0.013)
IRF9540P_TO-220
  rect 1.801x2.601 hole 1.199: 1(-2.54,0)
  oval 1.801x2.601 hole 1.199: 2(0,0) 3(2.54,-0.01)
L0603
  rect 0.8x0.864 smd: 1(-0.7,0) 2(0.7,0)
LED0603-RD_RED
  rect 0.8x0.8 smd: 1(-0.799,-0.004) 2(0.799,0.004)
LQFP-48_L7.0-W7.0-P0.50-LS9.0-BL
  oval 0.27x1.5 smd: 1(-2.75,-4.25) 2(-2.25,-4.25) 3(-1.75,-4.25) 4(-1.25,-4.25) 5(-0.75,-4.25) 6(-0.25,-4.25) 7(0.25,-4.25) 8(0.75,-4.25) 9(1.25,-4.25) 10(1.75,-4.25) 11(2.25,-4.25) 12(2.75,-4.25) 25(2.75,4.25) 26(2.25,4.25) 27(1.75,4.25) 28(1.25,4.25) 29(0.75,4.25) 30(0.25,4.25) 31(-0.25,4.25) 32(-0.75,4.25) 33(-1.25,4.25) 34(-1.75,4.25) 35(-2.25,4.25) 36(-2.75,4.25)
  oval 1.5x0.27 smd: 13(4.25,-2.75) 14(4.25,-2.25) 15(4.25,-1.75) 16(4.25,-1.25) 17(4.25,-0.75) 18(4.25,-0.25) 19(4.25,0.25) 20(4.25,0.75) 21(4.25,1.25) 22(4.25,1.75) 23(4.25,2.25) 24(4.25,2.75) 37(-4.25,2.75) 38(-4.25,2.25) 39(-4.25,1.75) 40(-4.25,1.25) 41(-4.25,0.75) 42(-4.25,0.25) 43(-4.25,-0.25) 44(-4.25,-0.75) 45(-4.25,-1.25) 46(-4.25,-1.75) 47(-4.25,-2.25) 48(-4.25,-2.75)
R0603
  rect 0.806x0.864 smd: 1(-0.753,0) 2(0.753,0)
SMA_L4.3-W2.6-LS5.0-RD
  rect 2.046x1.62 smd: 1(-2.404,-0.009) 2(2.404,0.009)
SOD-123_L2.7-W1.6-LS3.7-RD
  rect 0.91x1.22 smd: 1(-1.635,0) 2(1.635,0)
SOD-323_L1.7-W1.3-LS2.5-BI
  rect 0.8x0.8 smd: 1(-1.205,0) 2(1.205,0)
SOD-882_L1.0-W0.6-BI
  rect 0.3x0.6 smd: 1(-0.325,0) 2(0.325,0)
SOIC-8_L4.9-W3.9-P1.27-LS6.0-BL
  oval 0.588x2.045 smd: 1(-1.905,-2.772) 2(-0.635,-2.772) 3(0.635,-2.772) 4(1.905,-2.772) 5(1.905,2.772) 6(0.635,2.772) 7(-0.635,2.772) 8(-1.905,2.772)
SOIC-8_L4.9-W3.9-P1.27-LS6.0-BL-EP3.1-1
  oval 0.63x1.865 smd: 1(-1.905,-2.683) 2(-0.635,-2.683) 3(0.635,-2.683) 4(1.905,-2.683) 5(1.905,2.683) 6(0.635,2.683) 7(-0.635,2.683) 8(-1.905,2.683)
  rect 3.1x2.3 smd: 9(0,0)
SOIC-8_L4.9-W3.9-P1.27-LS6.0-TL
  oval 1.52x0.6 smd: 1(-2.74,1.905) 2(-2.74,0.635) 3(-2.74,-0.635) 4(-2.74,-1.905) 5(2.74,-1.905) 6(2.74,-0.635) 7(2.74,0.635) 8(2.74,1.905)
SOT-23-3_L2.9-W1.3-P1.90-LS2.4-BL-2
  rect 0.7x1.25 smd: 1(-0.95,-1) 2(0.95,-1) 3(0,1)
SOT-23-3_L2.9-W1.3-P1.90-LS2.4-BR
  rect 1.25x0.7 smd: 1(1,-0.95) 2(1,0.95) 3(-1,0)
SOT-223-4_L6.5-W3.5-P2.30-LS7.0-BR
  rect 2.47x0.98 smd: 1(2.835,-2.3) 2(2.835,0) 3(2.835,2.3)
  rect 2.47x3.6 smd: 4(-2.835,0)
SW-SMD_L6.0-W3.3-LS8.0
  rect 1.9x1.5 smd: 1(-4,0) 2(4,0)

## Nets
As in the schematic.

Pads without a net: CN1 5 6; CN2 5 6; CN3 3 4; U4 4 9; U8 5 8
